# EAGLE schematic dcmotor_power (EAGLE 5.10)
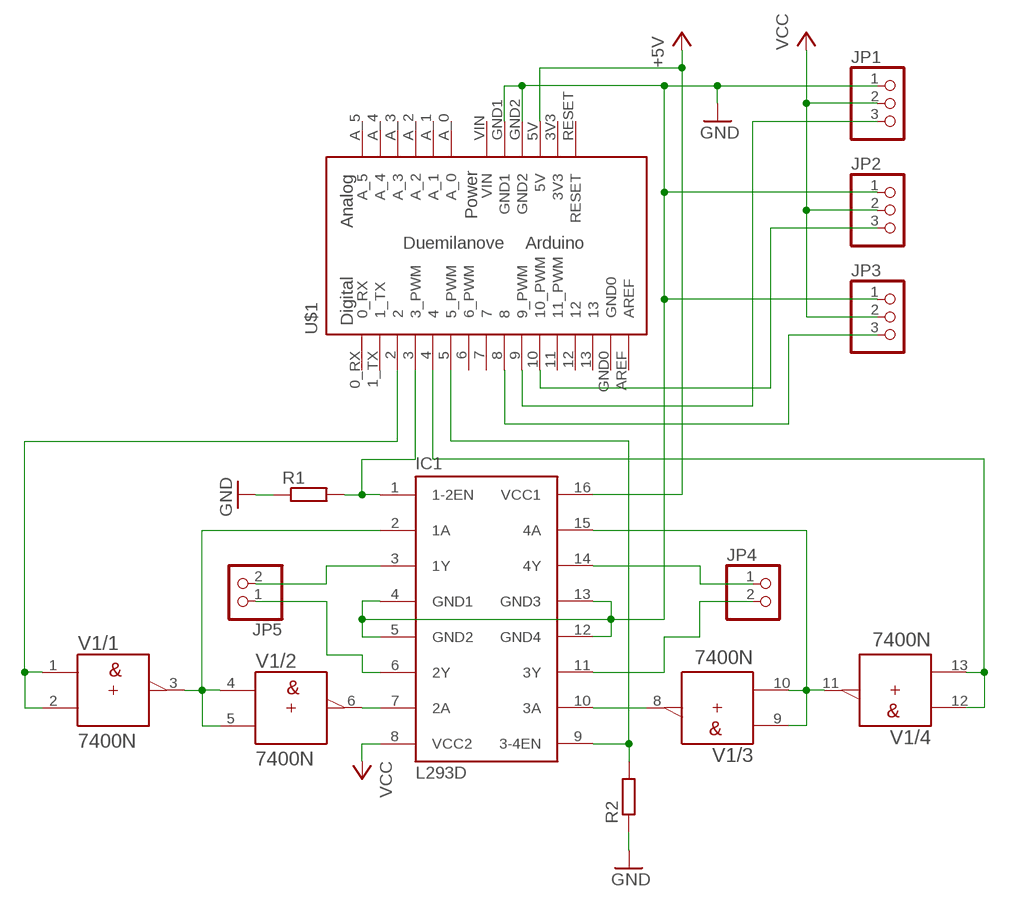
[diagram p0: schematic, sheet 1]

## Parts
IC1  L293D  [DIL16]
JP1  PINHD-1X3/90  [1X03/90]
JP2  PINHD-1X3/90  [1X03/90]
JP3  PINHD-1X3/90  [1X03/90]
JP4  PINHD-1X2/90  [1X02/90]
JP5  PINHD-1X2/90  [1X02/90]
R1  R-EU_0204/7  [0204/7]
R2  R-EU_0204/7  [0204/7]
U$1  ARDUINO-USBNO-OUTLINE-NO-TEXT-OCTAGONAL  [NO-OUTLINE-OCTAGONAL-NOTEXT]
V1  7400N  [DIL14]

## Nets
+5V: IC1.16(VCC1) U$1.5V
GND: IC1.4(GND1) IC1.5(GND2) IC1.12(GND4) IC1.13(GND3) JP1.1 JP2.1 JP3.1 R1.1 R2.1 U$1.GND1 U$1.GND2
N$1: IC1.15(4A) V1.9(/3:A) V1.10(/3:B) V1.11(/4:Y)
N$2: IC1.10(3A) V1.8(/3:Y)
N$3: U$1.4 V1.12(/4:A) V1.13(/4:B)
N$4: IC1.1(1-2EN) R1.2 U$1.3(3_PWM)
N$5: U$1.2 V1.1(/1:A) V1.2(/1:B)
N$6: IC1.2(1A) V1.3(/1:Y) V1.4(/2:A) V1.5(/2:B)
N$7: IC1.7(2A) V1.6(/2:Y)
N$8: IC1.9(3-4EN) R2.2 U$1.5(5_PWM)
N$10: JP2.3 U$1.10(10_PWM)
N$11: JP1.3 U$1.9(9_PWM)
N$12: JP3.3 U$1.8
N$13: IC1.3(1Y) JP5.2
N$14: IC1.6(2Y) JP5.1
N$15: IC1.14(4Y) JP4.1
N$16: IC1.11(3Y) JP4.2
VCC: IC1.8(VCC2) JP1.2 JP2.2 JP3.2
Unconnected: U$1.0_RX U$1.1_TX U$1.6(6_PWM) U$1.7 U$1.11(11_PWM) U$1.12 U$1.13 U$1.A_0 U$1.A_1 U$1.A_2 U$1.A_3 U$1.A_4 U$1.A_5 U$1.AREF U$1.GND0 U$1.RESET

## Power pins joined to a net without a drawn wire
3V3: U$1.3V3
+UB: V1.14(/+UB:+UB)
-UB: V1.7(/-UB:-UB)
VIN: U$1.VIN

## Library data of the parts
IC1 = st-microelectronics:L293D: PUSH-PULL 4 CHANNEL DRIVER
JP1-JP3 = pinhead:PINHD-1X3: PIN HEADER
JP4 JP5 = pinhead:PINHD-1X2: PIN HEADER
R1 R2 = resistor:R-EU_: RESISTOR, European symbol
U$1 = Arduino-Various:ARDUINO-USB: The Ardiuno Duemilanove Pinouts layoutet as a Bare Shield. v0.5 Also for Arduino Diecimila. This is designed as a Part and has no Outline in the Dimension Layer. The Outline, when present, is drawed at the tPlace / bPlace Layer. Library by Stephanie Lange, http://www.k-ita.de/~sl/
V1 = 74ttl-din:74*00: Quad 2-input NAND gate